# EAGLE design ai_breakout_apa102 (EAGLE 7.1.0)
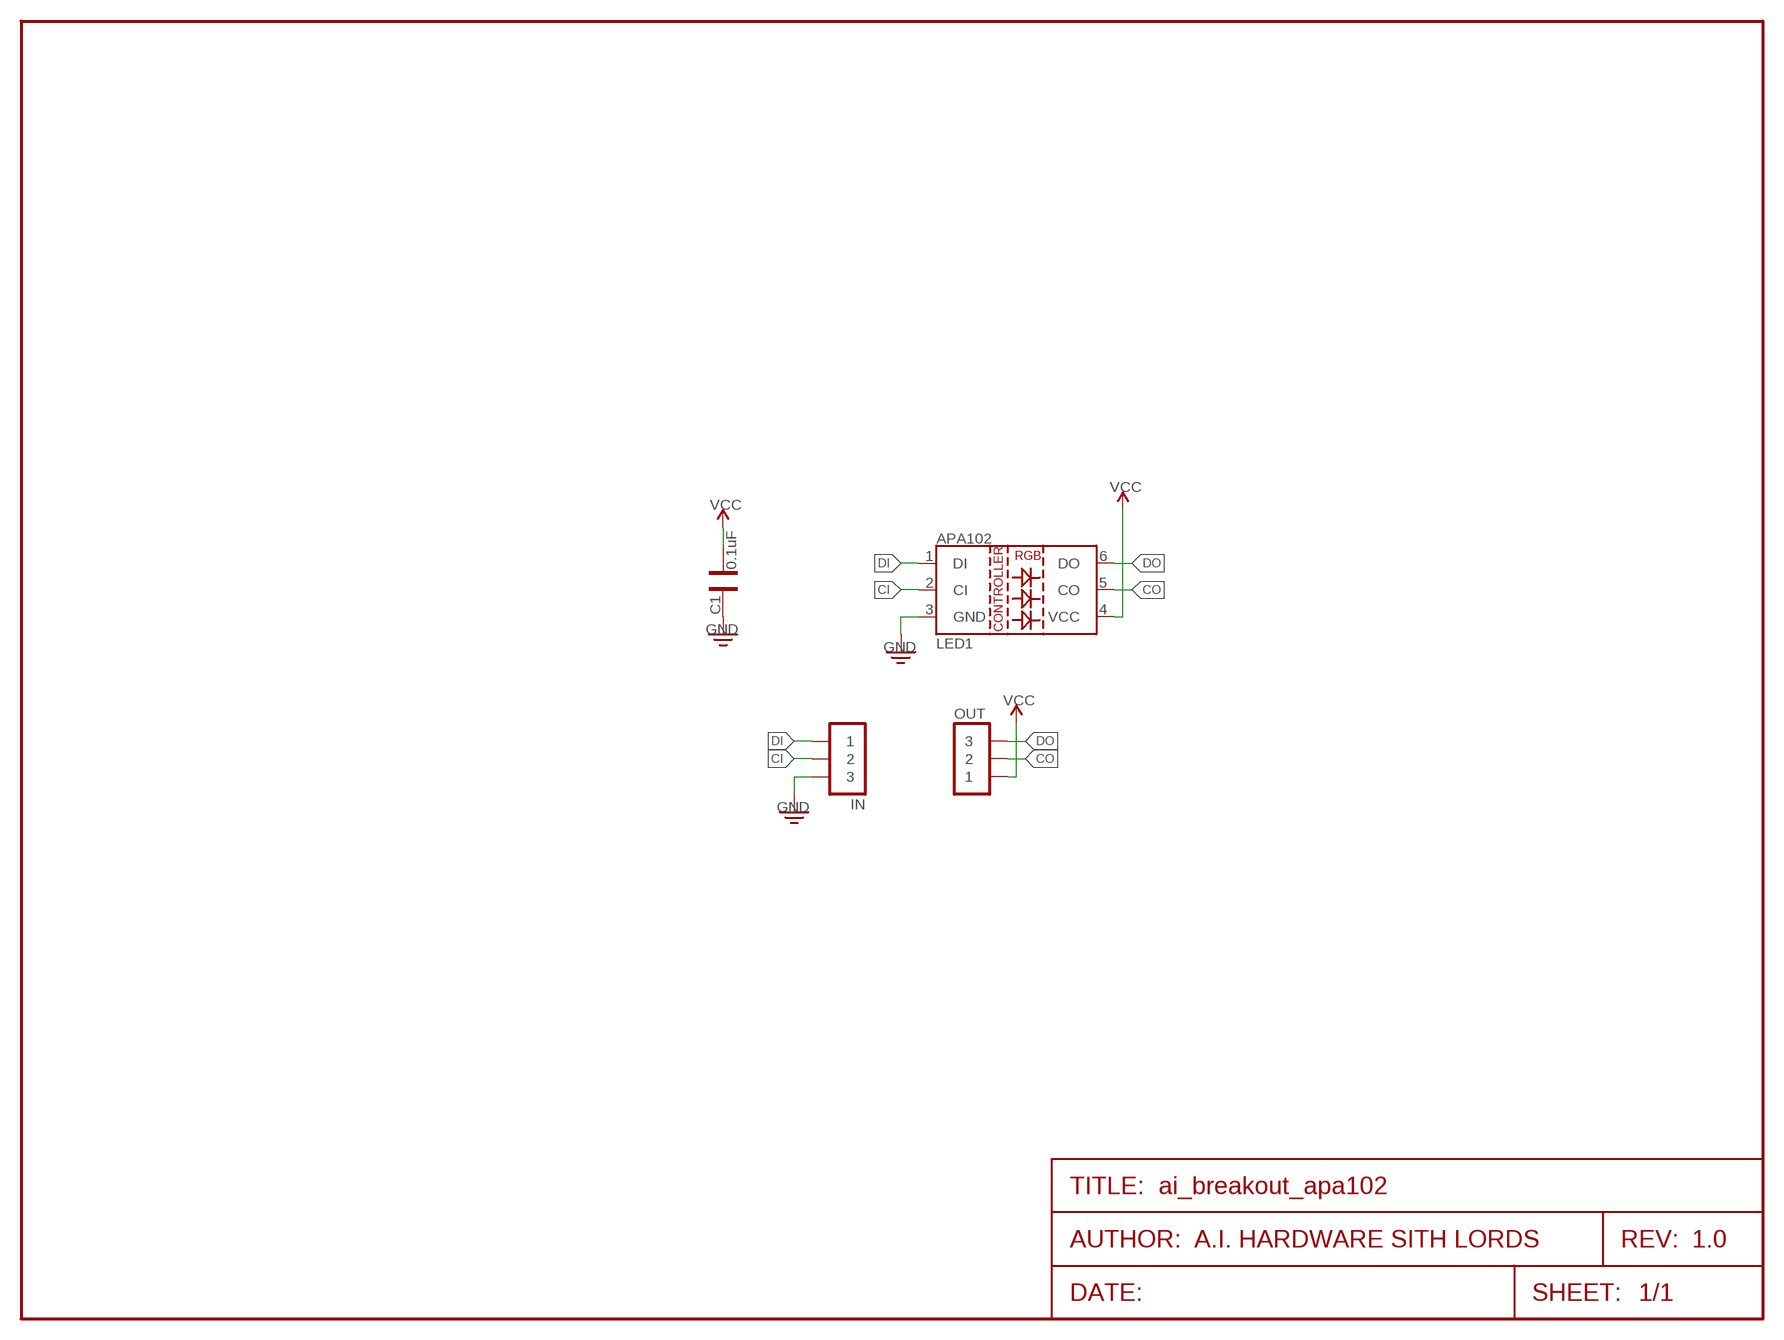
[diagram p0: schematic, sheet 1]
FRAME1 (FRAME-LETTER): AUTHOR: A.I. HARDWARE SITH LORDS; REV: 1.0

## Parts
C1  0.1uF  CAP0402  [CAP-0402]
IN  1X03  [1X03]
LED1  LED-APA102  [LED-APA102]
OUT  1X03NOFIRST  [1X03-NOFIRST]

## Nets
CI: IN.2 LED1.2(CI)
CO: LED1.5(CO) OUT.2
DI: IN.1 LED1.1(DI)
DO: LED1.6(DO) OUT.3
GND: C1.2 IN.3 LED1.3(GND)
VCC: C1.1 LED1.4(VCC) OUT.1

## Library data of the parts
C1 = Ai_Passives:CAP
IN OUT = Ai_Connectors:1X03
LED1 = Ai_LED:LED-APA102

## Board
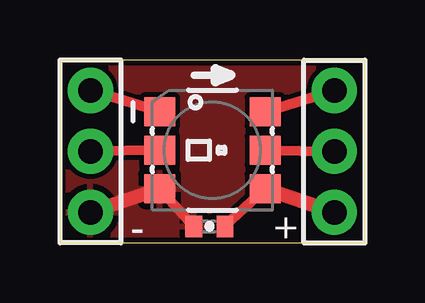
[diagram p1: board, top side]
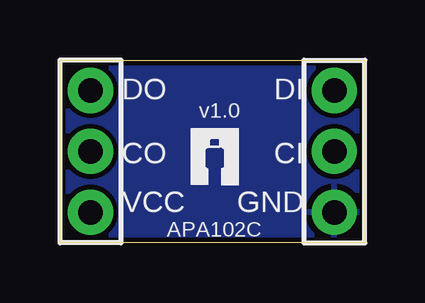
[diagram p2: board, bottom side, seen from below]

Size 12.7 x 7.62 mm. Coordinates in mm from the lower left corner, seen from the top.
Outline: 0,0 12.7,0 12.7,7.62 0,7.62 0,0
Copper layers (1*16): Top 0.035mm / dielectric 1.5mm / Bottom 0.035mm
Design rules "ai_2layer": minimum track width 7mil, minimum drill 15mil, track to track 8mil, track to pad 8mil, pad to pad 8mil, via to via 8mil, smd to smd 8mil, copper to edge 8mil, drill to drill 8mil, minimum pad ring 12mil, minimum via ring 10mil, stop-mask expansion 4mil, vias tented up to drill 20mil, thermal gap 10mil

### Footprints (pad centres in the part's own frame; a part is rotated, then mirrored left to right if it is on the bottom)
CAP-0402 = smd 0.7 x 0.9: 1 -0.65,0; 2 0.65,0
1X03 = drill 1.016 pad 1.88: 1 -2.54,0; 2 0,0; 3 2.54,0
LED-APA102 = smd 1.3 x 1.2: 1 -2.2,1.6; 2 -2.2,0; 3 -2.2,-1.6; 4 2.2,-1.6; 5 2.2,0; 6 2.2,1.6
1X03-NOFIRST = drill 1.016 pad 1.88: 1 -2.54,0; 2 0,0; 3 2.54,0

### Placement (x,y rotation side)
C1  6.22,0.69 180 top
IN  1.27,3.81 270 top
LED1  6.35,3.86 0 top
OUT  11.43,3.81 90 top
U$5  [AI-LOGO-XS]  7.24,2.41 0 bottom

### Tracks (layer width: path | path; a pad name or v marks a point on that pad's centre or on a via)
CI
  Top 0.406: LED1.2 IN.2
CO
  Top 0.406: LED1.5 OUT.2
DI
  Top 0.406: LED1.1 IN.1
DO
  Top 0.406: LED1.6 OUT.3
GND
  Top 0.406: LED1.3 C1.2
  Top 0.61: IN.3 LED1.3
  pour Top: 0,7.62 12.7,7.62 12.7,0 0,0
  pour Bottom: 0,7.62 12.7,7.62 12.7,0 0,0
VCC
  Top 0.406: C1.1 LED1.4
  Top 0.61: LED1.4 OUT.1

### Text on the board
tPlace: - | +
bPlace: DI | DO | v1.0 | CI | CO | GND | VCC | APA102C